# EAGLE design Lightweight_2022_04 (EAGLE 9.6.2)
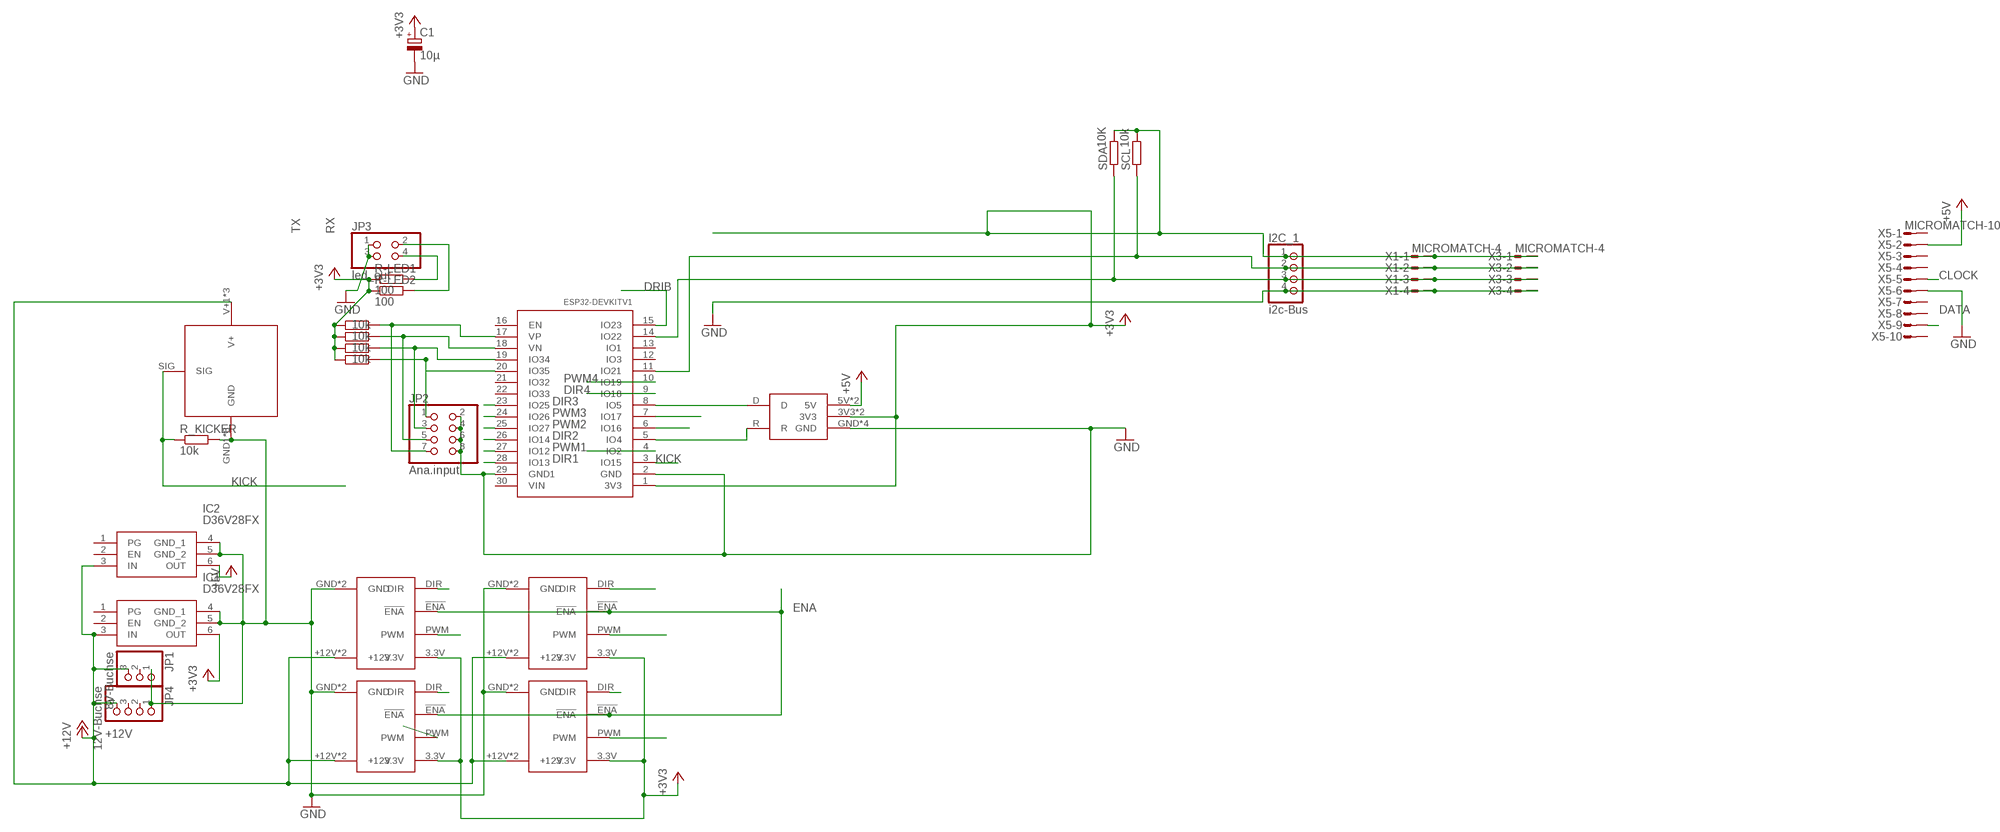
[diagram p0: schematic, sheet 1]

## Parts
C1  10µ  CPOL-EUE2,5-6E  [E2,5-6E]
I2C_1  i2c-Bus  PINHD-1X4  [1X04]
IC1  D36V28FX  [D36V28FX]
IC2  D36V28FX  [D36V28FX]
JP1  8V-Buchse  PINHD-1X3  [1X03]
JP2  Ana.input  PINHD-2X4  [2X04]
JP3  led_out  PINHD-2X2  [2X02]
JP4  12V-Buchse  PINHD-1X4  [1X04]
R-LED1  100  R-EU_0207/10  [0207/10]
R-LED2  100  R-EU_0207/10  [0207/10]
R_AD14  10k  R-EU_0207/10  [0207/10]
R_AD25  10k  R-EU_0207/10  [0207/10]
R_AD26  10k  R-EU_0207/10  [0207/10]
R_AD27  10k  R-EU_0207/10  [0207/10]
R_KICKER  10k  R-EU_0207/10  [0207/10]
SCL  10k  R-EU_0207/10  [0207/10]
SDA  10K  R-EU_0207/10  [0207/10]
U$5  CANBUS  [CANBUS]
U$11  IFX9201BREAKOUT  [IFX9201BREAKOUT]
U$13  ESP32DEVKITV1  [ESP32-DEVKITV1]
U$14  IFX9201BREAKOUT  [IFX9201BREAKOUT]
U$15  IFX9201BREAKOUT  [IFX9201BREAKOUT]
U$16  IFX9201BREAKOUT  [IFX9201BREAKOUT]
U$17  KICKER  [KICKER]
X1  MICROMATCH-4  [MICROMATCH-4]
X3  MICROMATCH-4  [MICROMATCH-4]
X5  MICROMATCH-10  [MICROMATCH-10]

## Nets
+3V3: C1.+ I2C_1.1 IC1.6(OUT) R-LED1.1 R-LED2.1 R_AD14.1 R_AD25.1 R_AD26.1 R_AD27.1 SCL.2 SDA.2 U$5.3V3 U$5.3V3_1(3V3) U$11.3.3V U$13.1(3V3) U$14.3.3V U$15.3.3V U$16.3.3V X1.1 X3.1
+5V: IC2.6(OUT) U$5.5V U$5.5V_1(5V) X5.2
+12V: IC1.3(IN) IC2.3(IN) JP1.3 JP4.4 U$11.+12V U$11.+12V2(+12V) U$14.+12V U$14.+12V2(+12V) U$15.+12V U$15.+12V2(+12V) U$16.+12V U$16.+12V2(+12V) U$17.V+1(V+) U$17.V+2(V+) U$17.V+3(V+)
CLOCK: I2C_1.3 SDA.1 U$13.14(IO22) X1.3 X3.3 X5.5
D: U$5.D U$13.8(IO5)
DATA: I2C_1.2 SCL.1 U$13.11(IO21) X1.2 X3.2 X5.9
DIR1: U$13.28(IO13) U$16.DIR
DIR2: U$13.26(IO14) U$15.DIR
DIR3: U$11.DIR U$13.23(IO25)
DIR4: U$13.9(IO18) U$14.DIR
DRIB: U$13.15(IO23)
ENA: U$11.!ENA U$13.4(IO2) U$14.!ENA U$15.!ENA U$16.!ENA
GND: C1.- I2C_1.4 IC1.4(GND_1) IC1.5(GND_2) IC2.4(GND_1) IC2.5(GND_2) JP1.1 JP2.2 JP2.4 JP2.6 JP2.8 JP3.1 JP3.3 JP4.1 R_KICKER.2 U$5.GND U$5.GND_1(GND) U$5.GND_2(GND) U$5.GND_3(GND) U$11.GND U$11.GND2(GND) U$13.2(GND) U$13.29(GND1) U$14.GND U$14.GND2(GND) U$15.GND U$15.GND2(GND) U$16.GND U$16.GND2(GND) U$17.GND1(GND) U$17.GND2(GND) U$17.GND3(GND) U$17.GND4(GND) U$17.GND5(GND) U$17.GND6(GND) U$17.GND7(GND) U$17.GND8(GND) X1.4 X3.4 X5.6
KICK: R_KICKER.1 U$13.3(IO15) U$17.SIG
N$1: JP2.7 R_AD25.2 U$13.17(VP)
N$2: JP2.5 R_AD26.2 U$13.18(VN)
N$3: JP2.3 R_AD27.2 U$13.19(IO34)
N$4: JP2.1 R_AD14.2 U$13.20(IO35)
N$8: JP3.4 R-LED1.2
N$9: JP3.2 R-LED2.2
PWM1: U$13.27(IO12) U$16.PWM
PWM2: U$13.25(IO27) U$15.PWM
PWM3: U$11.PWM U$13.24(IO26)
PWM4: U$13.10(IO19) U$14.PWM
R: U$5.R U$13.5(IO4)
RX: U$13.6(IO16)
TX: U$13.7(IO17)
Unconnected: IC1.1(PG) IC1.2(EN) IC2.1(PG) IC2.2(EN) JP1.2 JP4.2 JP4.3 U$13.12(IO3) U$13.13(IO1) U$13.16(EN) U$13.21(IO32) U$13.22(IO33) U$13.30(VIN) X5.1 X5.3 X5.4 X5.7 X5.8 X5.10

## Library data of the parts
C1 = rcl:CPOL-EU: POLARIZED CAPACITOR, European symbol; SPICEPREFIX: C
I2C_1 JP4 = pinhead:PINHD-1X4: PIN HEADER
IC1 IC2 = D36V28FX:D36V28FX: 5V, 3.2A Step-Down Voltage Regulator D36V28F5 Source: Datasheet <https://www.pololu.com/product/3782>; DESCRIPTION: 5V, 3.2A Step-Down Voltage Regulator D36V28F5; HEIGHT: 8.77mm; MANUFACTURER_NAME: POLOLU ROBOTICS & ELECTRONICS; MANUFACTURER_PART_NUMBER: D36V28FX
JP1 = pinhead:PINHD-1X3: PIN HEADER
JP2 = pinhead:PINHD-2X4: PIN HEADER
JP3 = pinhead:PINHD-2X2: PIN HEADER
R-LED1 R-LED2 R_AD14 R_AD25-R_AD27 R_KICKER SCL SDA = rcl:R-EU_: RESISTOR, European symbol; SPICEPREFIX: R
U$5 = canbus:CANBUS
U$11 U$14-U$16 = ifx9201breakout:IFX9201BREAKOUT
U$13 = ESP32-DEVKITV1:ESP32DEVKITV1
U$17 = kicker:KICKER
X1 X3 = con-amp-micromatch:MICROMATCH-4: MicroMaTch 4 7-215464-4 / 0-215464-4 Drawing Number C-215464 DDEController.pdf; MPN: 7-215464-4; OC_FARNELL: 3784629; OC_NEWARK: 19R8124
X5 = con-amp-micromatch:MICROMATCH-10: MicroMaTch 10 8-215464-0 / 1-215464-0 Drawing Number C-215464 DDEController.pdf; MF: FARNELL; MPN: 8-215464-0; OC_FARNELL: 3784654; OC_NEWARK: 19J6430

## Board
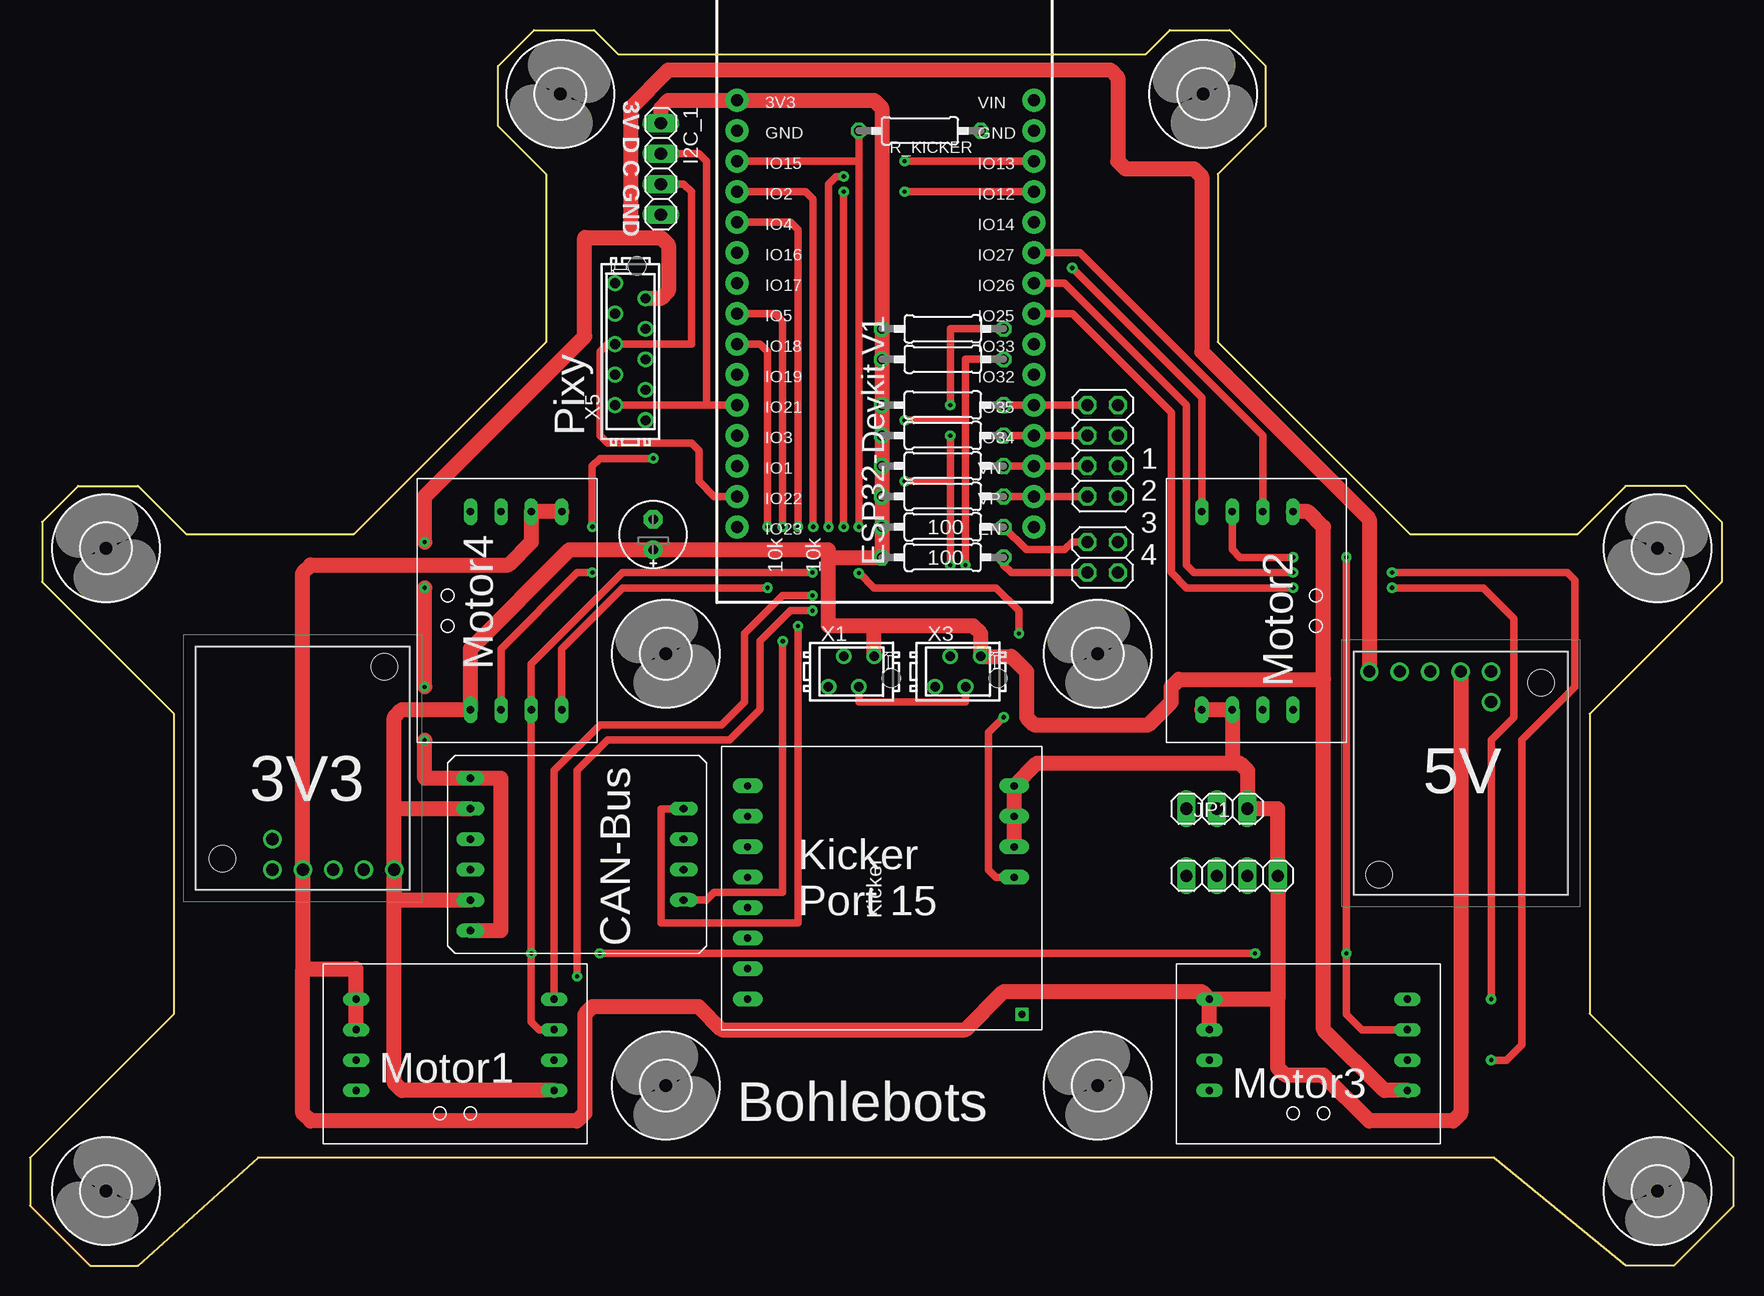
[diagram p1: board, top side]
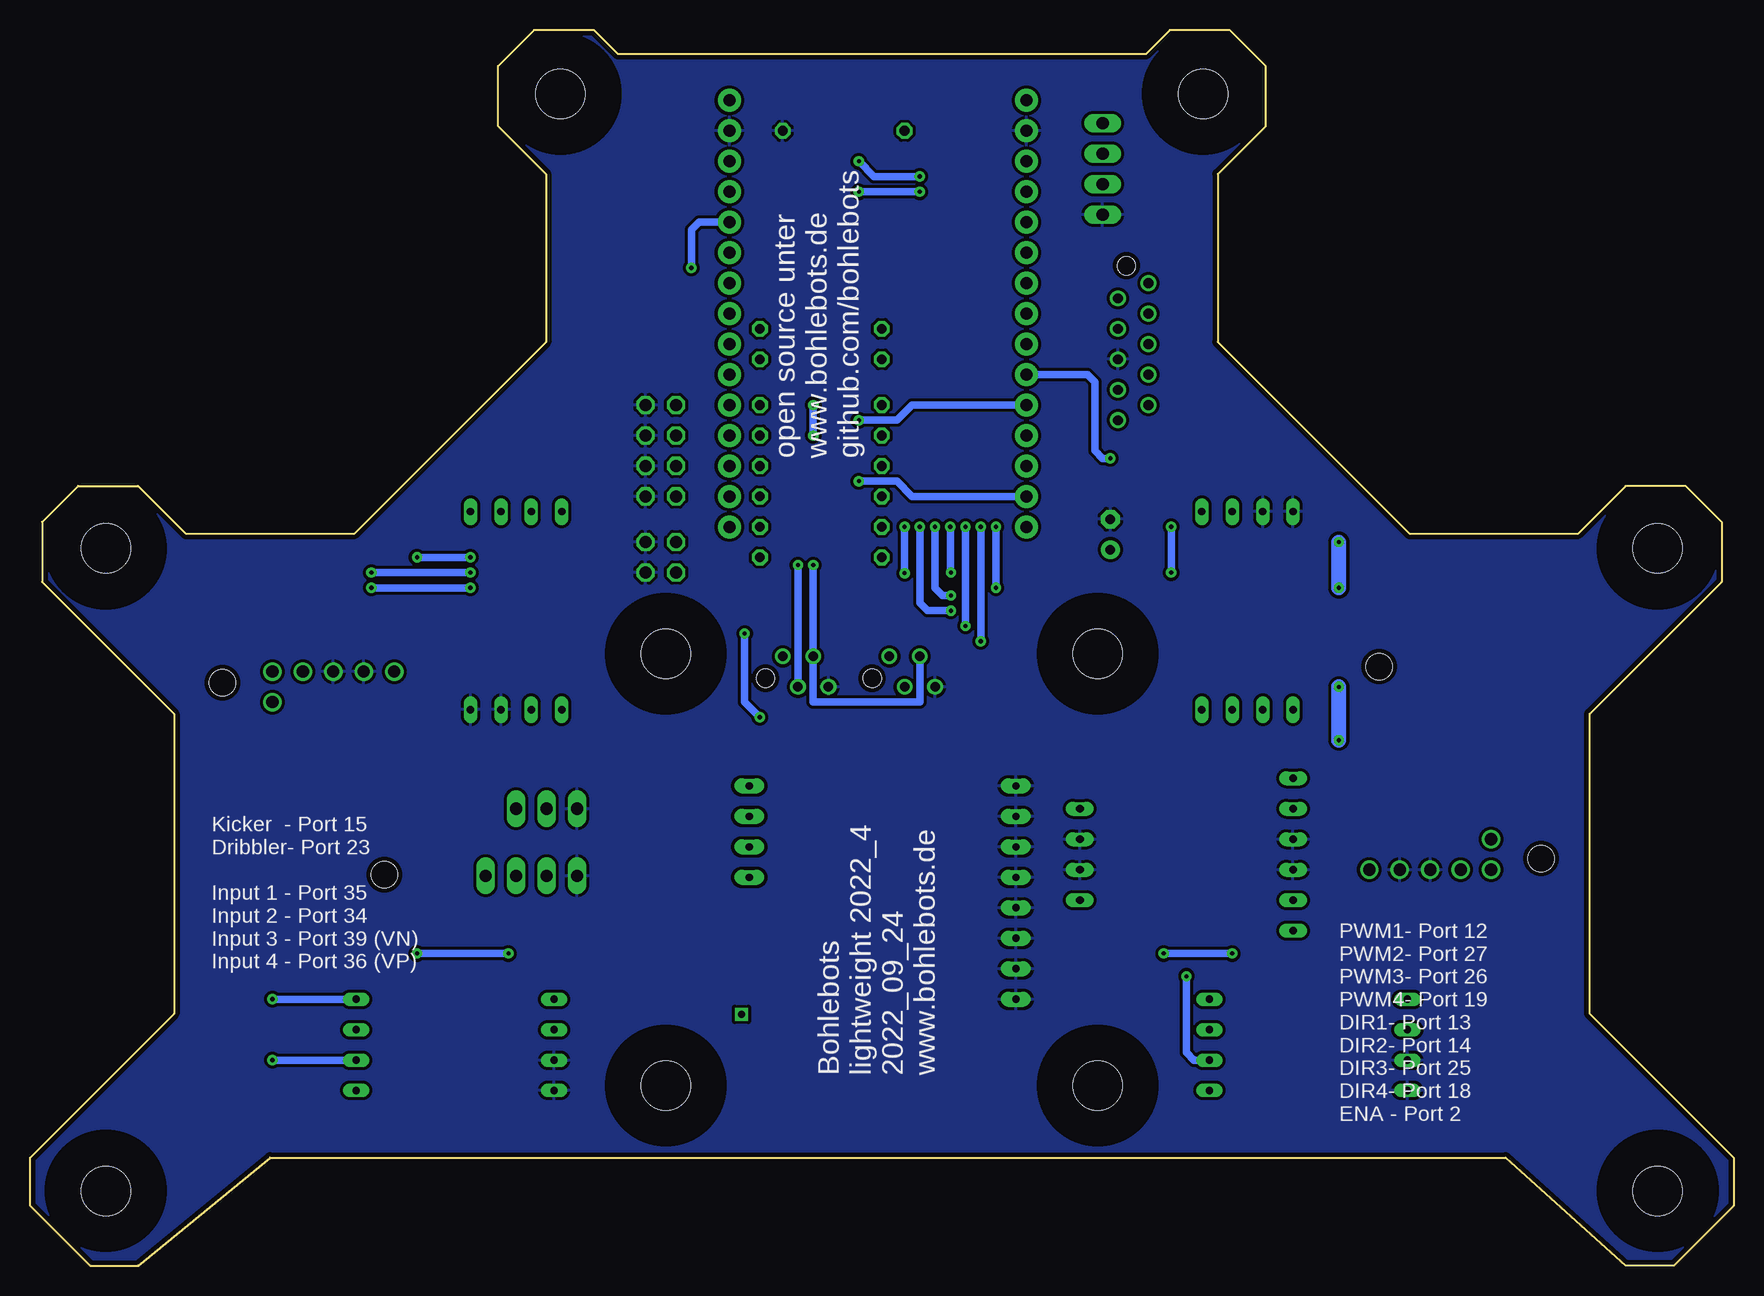
[diagram p2: board, bottom side, seen from below]

Size 142 x 103 mm. Coordinates in mm from the lower left corner, seen from the top.
Outline: 12,21 12,46 1,57 1,62 4,65 9,65 13,61 27,61 43,77 43,91 39,95 39,100 42,103 47,103 49,101 93,101 95,103 100,103 103,100 103,95 99,91 99,77 115,61 129,61 133,65 138,65 141,62 141,57 130,46 130,21 142,9 142,5 137,0 133,0 122,9 19,9 9,0 5,0 0,5 0,9 12,21
Copper layers (1*16): Top 0.035mm / dielectric 1.5mm / Bottom 0.035mm
Design rules "default *": minimum track width 10mil, minimum drill 8mil, track to track 10mil, track to pad 10mil, pad to pad 10mil, via to via 10mil, smd to smd 10mil, copper to edge 15mil, drill to drill 8mil, minimum pad ring 10mil, minimum via ring 10mil, stop-mask expansion 0mil, vias tented up to drill 0mil, thermal gap 10mil

### Footprints (pad centres in the part's own frame; a part is rotated, then mirrored left to right if it is on the bottom)
E2,5-6E = drill 0.813 pad 1.575: + -1.27,0 | drill 0.813 pad 1.575 octagon: - 1.27,0
1X04 = drill 1.016 long: 1 -3.81,0; 2 -1.27,0; 3 1.27,0; 4 3.81,0
D36V28FX = drill 1.02 pad 1.53: 1 0,0; 2 0,-2.54; 3 2.54,-2.54; 4 5.08,-2.54; 5 7.62,-2.54; 6 10.16,-2.54 | hole 2.18: -4.17,-1.61; 9.33,14.39
1X03 = drill 1.016 long: 1 -2.54,0; 2 0,0; 3 2.54,0
2X04 = drill 1.016 octagon: 1 -3.81,-1.27; 2 -3.81,1.27; 3 -1.27,-1.27; 4 -1.27,1.27; 5 1.27,-1.27; 6 1.27,1.27; 7 3.81,-1.27; 8 3.81,1.27
2X02 = drill 1.016 octagon: 1 -1.27,-1.27; 2 -1.27,1.27; 3 1.27,-1.27; 4 1.27,1.27
0207/10 = drill 0.813 octagon: 1 -5.08,0; 2 5.08,0
4,1 = hole 4.1: 0,0
CANBUS = drill 0.65 long: 3V3 8.89,3.81; 3V3_1 8.89,-3.81; 5V 8.89,6.35; 5V_1 8.89,-6.35; D -8.89,3.81; GND -8.89,1.27; GND_1 -8.89,-1.27; GND_2 8.89,1.27; GND_3 8.89,-1.27; R -8.89,-3.81
IFX9201BREAKOUT = drill 0.6 long: 3.3V -3.81,-8.255; !ENA 1.27,-8.255; +12V 1.27,8.255; +12V2 3.81,8.255; DIR 3.81,-8.255; GND -3.81,8.255; GND2 -1.27,8.255; PWM -1.27,-8.255
ESP32-DEVKITV1 = drill 1 pad 1.93: 1 -22.87,-13.54; 2 -20.33,-13.54; 3 -17.79,-13.54; 4 -15.25,-13.54; 5 -12.71,-13.54; 6 -10.17,-13.54; 7 -7.63,-13.54; 8 -5.09,-13.54; 9 -2.55,-13.54; 10 -0.01,-13.54; 11 2.53,-13.54; 12 5.07,-13.54; 13 7.61,-13.54; 14 10.15,-13.54; 15 12.69,-13.54; 16 12.69,11.23; 17 10.15,11.23; 18 7.61,11.23; 19 5.07,11.23; 20 2.53,11.23; 21 -0.01,11.23; 22 -2.55,11.23; 23 -5.09,11.23; 24 -7.63,11.23; 25 -10.17,11.23; 26 -12.71,11.23; 27 -15.25,11.23; 28 -17.79,11.23; 29 -20.33,11.23; 30 -22.87,11.23
KICKER = drill 0.6 pad 1.27 long: GND1 2.54,24.511; GND2 5.08,24.511; GND3 7.62,24.511; GND4 10.16,24.511; GND5 12.7,24.511; GND6 15.24,24.511; GND7 17.78,24.511; GND8 20.32,24.511; SIG 12.7,2.286; V+1 15.24,2.286; V+2 17.78,2.286; V+3 20.32,2.286 | drill 0.6 square: NC 1.27,1.651
MICROMATCH-4 = drill 0.8: 1 1.905,1.27; 2 0.635,-1.27; 3 -0.635,1.27; 4 -1.905,-1.27 | hole 1.5: 3.34,-0.55
MICROMATCH-10 = drill 0.813: 1 5.715,1.27; 2 4.445,-1.27; 3 3.175,1.27; 4 1.905,-1.27; 5 0.635,1.27; 6 -0.635,-1.27; 7 -1.905,1.27; 8 -3.175,-1.27; 9 -4.445,1.27; 10 -5.715,-1.27 | hole 1.5: 7.16,-0.55

### Placement (x,y rotation side)
C1  51.95,60.94 90 top
I2C_1  52.59,91.42 270 top
IC1  20.2,35.54 0 top
IC2  121.8,46.97 180 top
JP1  98.94,38.08 0 top
JP2  89.41,67.92 270 top
JP3  89.41,59.03 90 top
JP4  100.21,32.49 0 top
R-LED1  76.08,61.58 0 top
R-LED2  76.08,59.03 0 top
R_AD14  76.08,71.73 0 top
R_AD25  76.08,64.11 0 top
R_AD26  76.08,66.66 0 top
R_AD27  76.08,69.19 0 top
R_KICKER  74.17,94.59 0 top
SCL  76.08,75.55 180 top
SDA  76.08,78.09 180 top
U$1  [4,1]  53,15 67.5 top
U$2  [4,1]  6.33,59.79 67.5 top
U$3  [4,1]  53,51 67.5 top
U$4  [4,1]  97.79,97.67 67.5 top
U$5  45.6,34.27 180 top
U$6  [4,1]  135.67,6.21 67.5 top
U$7  [4,1]  89,15 67.5 top
U$8  [4,1]  89,51 67.5 top
U$9  [4,1]  44.21,97.67 22.5 top
U$10  [4,1]  135.67,59.79 22.5 top
U$11  106.56,18.39 90 top
U$12  [4,1]  6.33,6.21 22.5 top
U$13  72.47,74.27 270 top
U$14  40.52,54.59 0 top
U$15  101.48,54.59 180 top
U$16  35.44,18.39 90 top
U$17  84.34,19.66 90 top
X1  68.46,49.51 0 top
X3  77.35,49.51 0 top
X5  50.05,76.18 90 top

### Tracks (layer width: path | path; a pad name or v marks a point on that pad's centre or on a via)
+3V3
  Top 1.27: 66.56,59.03 R-LED2.1 R-LED1.1 R_AD25.1 R_AD26.1 R_AD27.1 R_AD14.1 SCL.2 SDA.2 71,96.5 70.36,97.14 U$13.1 53.22,97.14 52.59,96.5 I2C_1.1 | IC1.6 30.36,30.46 U$5.3V3 | U$16.3.3V 30.99,14.59 30.36,15.22 IC1.6 | IC1.6 30.36,38.08 | 30.36,38.08 30.36,45.7 30.99,46.34 U$14.3.3V 36.71,51.41 44.97,59.67 C1.+ 66.56,59.67 66.56,59.03 | U$11.3.3V 112.91,14.59 107.83,19.66 107.83,48.88 | 107.83,48.88 107.83,61.58 106.56,62.84 U$15.3.3V | X1.1 70.36,53.32 | 66.56,59.03 66.56,53.32 70.36,53.32 | 70.36,53.32 78.62,53.32 79.25,52.69 X3.1 81.8,50.78 83.06,49.51 83.06,45.7 83.7,45.06 93.22,45.06 95.13,46.97 95.13,48.24 95.77,48.88 107.83,48.88 | U$5.3V3_1 30.36,38.08
+5V  (via drill 0.35)
  Top 1.27: 50.05,85.7 50.05,96.5 53.22,99.67 90.05,99.67 90.69,99.04 90.69,92.06 91.32,91.42 97.03,91.42 97.67,90.78 97.67,76.18 111.64,62.21 IC2.6 | 50.05,85.7 52.59,85.7 53.22,85.07 53.22,81.26 52.59,80.62 X5.2 | U$5.5V 39.25,27.92 39.25,40.62 U$5.5V_1 32.9,40.62 v32.9,43.8 | v32.9,48.24 v32.9,56.5 | v32.9,60.3 32.9,64.11 46.23,77.45 46.23,85.7 50.05,85.7
  Bottom 1.27: v32.9,43.8 v32.9,48.24 | v32.9,56.5 v32.9,60.3
+12V
  Top 1.27: U$16.+12V U$16.+12V2 27.19,24.74 22.74,24.74 | U$11.+12V U$11.+12V2 | U$15.+12V2 U$15.+12V 100.21,41.89 | U$14.+12V2 U$14.+12V 41.79,60.3 39.89,58.4 23.38,58.4 22.74,57.77 IC1.3 22.74,24.74 | 104.02,22.2 JP4.4 104.02,38.08 JP1.3 101.48,41.26 100.84,41.89 100.21,41.89 | 104.02,22.2 U$11.+12V2 | 100.21,41.89 83.95,41.89 U$17.V+3 U$17.V+2 U$17.V+1 | 22.74,24.74 22.74,12.68 23.38,12.05 45.6,12.05 46.23,12.68 46.23,20.94 46.87,21.57 55.76,21.57 57.66,19.66 77.98,19.66 81.16,22.84 97.67,22.84 U$11.+12V2 | 104.02,22.2 104.02,16.49 104.66,15.86 107.83,15.86 111.64,12.05 118.62,12.05 119.26,12.68 IC2.3
CLOCK  (via drill 0.35)
  Top 0.61: U$13.14 57.03,64.11 55.76,65.38 55.76,67.92 55.12,68.56 48.14,68.56 47.5,69.19 47.5,76.18 48.14,76.81 X5.5 55.12,76.81 55.12,89.52 54.49,90.15 I2C_1.3 | v72.91,65.38 76.72,65.38 | 76.72,65.38 v76.72,58.4 | SDA.1 76.72,78.09 v76.72,71.73 | v76.72,69.19 76.72,65.38
  Bottom 0.61: X1.3 67.83,46.97 76.72,46.97 X3.3 v76.72,58.4 | U$13.14 68.46,64.11 69.73,65.38 v72.91,65.38 | v76.72,71.73 v76.72,69.19
D  (via drill 0.35)
  Top 0.61: U$13.8 62.11,79.35 62.74,78.72 v62.74,61.58 | v62.74,52.05 62.74,31.09 57.03,31.09 56.39,30.46 U$5.D
  Bottom 0.61: v62.74,61.58 v62.74,52.05
DATA  (via drill 0.35)
  Top 0.61: X3.2 77.98,46.97 69.09,46.97 X1.2 | U$13.11 56.39,71.73 | 56.39,71.73 X5.9 | I2C_1.2 55.76,92.69 56.39,92.06 56.39,71.73 | 77.98,70.47 v77.98,58.4 | v72.91,70.47 77.98,70.47 | SCL.1 77.98,75.55 77.98,70.47
  Bottom 0.61: U$13.11 68.46,71.73 69.73,70.47 v72.91,70.47 | X3.2 v77.98,58.4
DIR1  (via drill 0.35)
  Top 0.61: U$13.28 v72.91,92.06 | v67.83,90.78 67.19,90.78 66.56,90.15 v66.56,61.58 | v65.24,55.86 62.74,55.86 59.57,52.69 59.57,46.97 57.66,45.06 47.5,45.06 43.7,41.26 U$16.DIR
  Bottom 0.61: v72.91,92.06 71.64,90.78 v67.83,90.78 | v66.56,61.58 66.56,56.5 65.92,55.86 v65.24,55.86
DIR2  (via drill 0.35)
  Top 0.61: U$15.DIR 97.67,72.37 v86.88,83.16
  Bottom 0.61: v86.88,83.16 86.88,86.34 86.24,86.97 U$13.26
DIR3  (via drill 0.35)
  Top 0.61: v121.8,22.2 121.8,43.8 123.7,45.7 123.7,53.95 121.16,56.5 v113.55,56.5 | U$13.23 86.88,79.35 95.13,71.1 95.13,57.77 96.4,56.5 v105.29,56.5
  Bottom 0.61: U$11.DIR v121.8,22.2 | v105.29,56.5 v113.55,56.5
DIR4  (via drill 0.35)
  Top 0.61: U$13.9 60.84,76.81 61.48,76.18 v61.48,61.58 | U$14.DIR 44.33,51.41 49.41,56.5 v61.48,56.5
  Bottom 0.61: v61.48,56.5 v61.48,61.58
ENA  (via drill 0.35)
  Top 0.61: U$16.!ENA 42.42,19.66 41.79,20.3 v41.79,26.02 U$14.!ENA 41.79,50.14 49.41,57.77 v65.24,57.77 | U$11.!ENA 111,19.66 109.73,20.94 v109.73,26.02 v109.73,59.03 | v105.29,59.03 100.84,59.03 100.21,59.67 U$15.!ENA | U$13.4 64.65,89.52 65.28,88.88 v65.28,61.58 | v47.5,26.02 v102.11,26.02
  Bottom 0.61: v109.73,59.03 v105.29,59.03 | v41.79,26.02 v47.5,26.02 | v102.11,26.02 v109.73,26.02 | v65.28,61.58 65.28,57.81 v65.24,57.77
GND
  pour Bottom: 41.33,104.77 100.67,104.77 142.77,62.67 142.77,4.33 131.67,-6.77 10.33,-6.77 -0.77,4.33 -0.77,62.67
KICK  (via drill 0.35)
  Top 0.61: R_KICKER.1 69.09,92.06 | U$13.3 69.09,92.06 | v69.09,57.72 69.14,57.72 70.36,56.5 80.53,56.5 82.43,54.59 v82.43,52.69 | v81.16,45.7 79.89,44.43 79.89,33 80.53,32.37 U$17.SIG | v69.09,61.58 69.09,92.05 69.09,92.06
  Bottom 0.61: v82.43,52.69 82.43,46.97 v81.16,45.7 | v69.09,57.72 v69.09,61.58
N$1
  Top 0.61: JP2.7 U$13.17 R_AD25.2
N$2
  Top 0.61: JP2.5 U$13.18 R_AD26.2
N$3
  Top 0.61: JP2.3 U$13.19 R_AD27.2
N$4
  Top 0.61: JP2.1 U$13.20 R_AD14.2
N$8
  Top 0.61: JP3.4 86.88,60.3 86.24,59.67 83.06,59.67 R-LED1.2
N$9
  Top 0.61: JP3.2 81.8,57.77 81.16,58.4 R-LED2.2
PWM1  (via drill 0.35)
  Top 0.61: U$13.27 v72.91,89.52 | v67.83,89.52 v67.83,61.58 | v65.24,54.59 63.38,54.59 60.84,52.05 60.84,46.34 58.3,43.8 48.14,43.8 45.6,41.26 v45.6,24.11
  Bottom 0.61: U$16.PWM 44.97,17.12 45.6,17.76 v45.6,24.11 | v72.91,89.52 v67.83,89.52 | v67.83,61.58 67.83,55.23 67.19,54.59 v65.24,54.59
PWM2
  Top 0.61: U$15.PWM 102.75,69.19 87.51,84.44 U$13.25
PWM3  (via drill 0.35)
  Top 0.61: v121.8,17.12 123.07,17.12 124.34,18.39 124.34,43.8 128.78,48.24 128.78,57.13 128.15,57.77 v113.55,57.77 | U$13.24 86.24,81.9 96.4,71.73 96.4,58.4 97.03,57.77 v105.29,57.77
  Bottom 0.61: U$11.PWM v121.8,17.12 | v105.29,57.77 v113.55,57.77
PWM4  (via drill 0.35)
  Top 0.61: U$14.PWM 39.25,51.41 45.6,57.77 v46.87,57.77 | v46.87,61.58 46.87,66.66 47.5,67.29 v51.95,67.29
  Bottom 0.61: U$13.10 53.86,74.28 53.22,73.64 53.22,67.92 52.59,67.29 v51.95,67.29 | v46.87,57.77 v46.87,61.58
R  (via drill 0.35)
  Top 0.61: U$13.5 63.38,86.97 64.02,86.34 v64.02,61.58 | U$5.R 52.59,38.08 52.59,28.55 64.02,28.55 v64.02,53.32
  Bottom 0.61: v64.02,61.58 v64.02,53.32

### Text on the board
tPlace: 3V D C GND
tNames: Pixy | Motor4 | 100 | 10k | 10k | 100 | 1 / 2 / 3 / 4 | Motor2 | 3V3 | 5V | Kicker / Port 15 | CAN-Bus | Motor1 | Motor3 | Bohlebots
bNames: open source unter / www.bohlebots.de / github.com/bohlebots | Kicker - Port 15 / Dribbler- Port 23 / / Input 1 - Port 35 / Input 2 - Port 34 / Input 3 - Port 39 (VN) / Input 4 - Port 36 (VP) | Bohlebots / lightweight 2022_4 / 2022_09_24 / www.bohlebots.de | PWM1- Port 12 / PWM2- Port 27 / PWM3- Port 26 / PWM4- Port 19 / DIR1- Port 13 / DIR2- Port 14 / DIR3- Port 25 / DIR4- Port 18 / ENA - Port 2